# Altium project Aurduino_Nano.PrjPcb
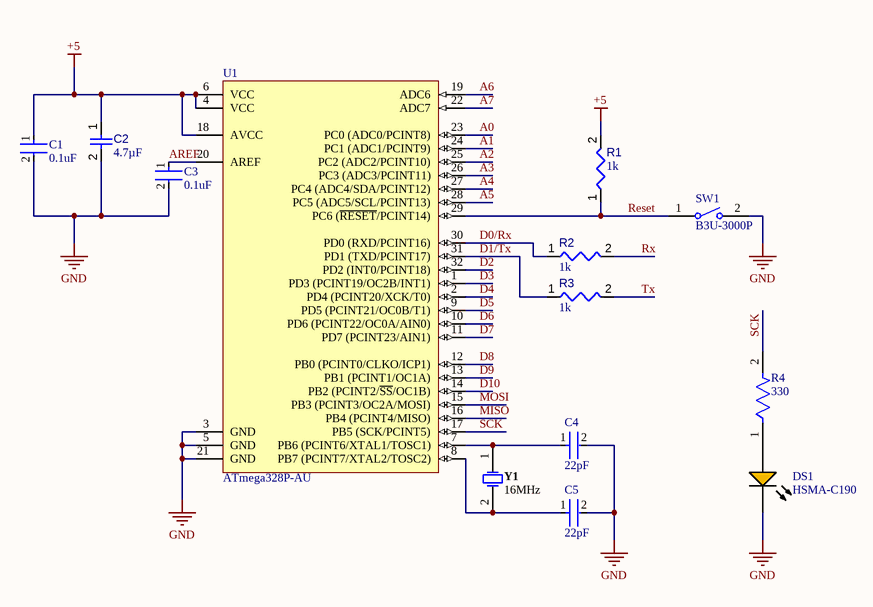
[diagram p0: 1_uC.SchDoc]
3 sheets, 27 parts. Net scope: global (net labels, ports and power ports of the same name join across sheets).
Board file: Aurduino_Nano.PcbDoc
Sheets:
  1_uC.SchDoc
  2_Power_Supply.SchDoc
  3_Connectors.SchDoc

## Sheet 1_uC.SchDoc
size A4; SheetNumber: 1; SheetTotal: 3

### Parts
C1  0.1uF  [FP-C0805C-DN-MFG]
C2  value 4.7µF  [CAPC0805(2012)145_L]  (hidden comment: Capacitor 4.7µF +/-40% 25V 0805)
C3  0.1uF  [FP-C0805C-DN-MFG]
C4  22pF  [FP-C0805C-DN-MFG]
C5  22pF  [FP-C0805C-DN-MFG]
DS1  HSMA-C190  [AVAG-HSMX-C190_V]
R1  value 1k  [RESC0805(2012)_L]  (hidden comment: 1KR5J)
R2  value 1k  [RESC0805(2012)_L]  (hidden comment: 1KR5J)
R3  value 1k  [RESC0805(2012)_L]  (hidden comment: 1KR5J)
R4  330  [FP-CRCW0805-e3-MFG]
SW1  B3U-3000P  [OMRON-B3U-3000P_V]
U1  ATmega328P-AU  [32A_M]
Y1  16MHz  [JPY-X053201602002_V]

### Nets
+5: C1.1 C2.1 R1.2 U1.4(VCC) U1.6(VCC) U1.18(AVCC)
GND: C1.2 C2.2 C3.2 C4.2 C5.2 DS1.2(K) SW1.2 U1.3(GND) U1.5(GND) U1.21(GND)
A0: U1.23(PC0_(ADC0/PCINT8))
A1: U1.24(PC1_(ADC1/PCINT9))
A2: U1.25(PC2_(ADC2/PCINT10))
A3: U1.26(PC3_(ADC3/PCINT11))
A4: U1.27(PC4_(ADC4/SDA/PCINT12))
A5: U1.28(PC5_(ADC5/SCL/PCINT13))
A6: U1.19(ADC6)
A7: U1.22(ADC7)
AREF: C3.1 U1.20(AREF)
D0/Rx: R2.1 U1.30(PD0_(RXD/PCINT16))
D1/Tx: R3.1 U1.31(PD1_(TXD/PCINT17))
D2: U1.32(PD2_(INT0/PCINT18))
D3: U1.1(PD3_(PCINT19/OC2B/INT1))
D4: U1.2(PD4_(PCINT20/XCK/T0))
D5: U1.9(PD5_(PCINT21/OC0B/T1))
D6: U1.10(PD6_(PCINT22/OC0A/AIN0))
D7: U1.11(PD7_(PCINT23/AIN1))
D8: U1.12(PB0_(PCINT0/CLKO/ICP1))
D9: U1.13(PB1_(PCINT1/OC1A))
D10: U1.14(PB2_(PCINT2/~{SS}/OC1B))
MISO: U1.16(PB4_(PCINT4/MISO))
MOSI: U1.15(PB3_(PCINT3/OC2A/MOSI))
Reset: R1.1 SW1.1 U1.29(PC6_(~{RESET}/PCINT14))
Rx: R2.2
SCK: R4.2 U1.17(PB5_(SCK/PCINT5))
Tx: R3.2
NetC4_1: C4.1 U1.7(PB6_(PCINT6/XTAL1/TOSC1)) Y1.1
NetC5_1: C5.1 U1.8(PB7_(PCINT7/XTAL2/TOSC2)) Y1.2
NetDS1_1: DS1.1(A) R4.1

### Library data of the parts
C1 C3 = CMP-03020-002581-2: C0805 0.10 μF X7R 30ppm/°C 20.00% 50 V; Manufacturer Part Number: C0805C104M5RAC; Manufacturer: KEMET; Capacitance: 0.10 μF; Voltage Rating: 50 V; Value: 0.10 μF; Tolerance: 0.2; Material: Ceramic; Category: Cap; Temperature: -55°C to +125°C; Lead Free: Yes; Device Class L3: Ceramic Capacitors; Package: C0805C-DN; Height: 0.88mm; Temperature Range High: +125°C; Device Class L2: Capacitors; Device Class L1: Passive Components; Temperature Coefficient: 30ppm/°C; ComponentLink2Description: Datasheet; RoHS: TRUE; Temperature Range Low: -55°C; ComponentLink2URL: https://content.kemet.com/datasheets/KEM_C1003_C0G_SMD.pdf; Temperature Characteristic: X7R; Mouser Description: Multilayer Ceramic Capacitors MLCC - SMD/SMT 50volts 0.1uF 20% X7R; Octopart: https://octopart.com/c0805c104m5rac-kemet-2226142; Ipc Land Pattern Name: CAPC200125X78; Automotive: No
C2 = CMP-001-00080-4: Chip Capacitor, 4.7µF +/-40%, 25V, 0805, Thickness 1.45 mm; Tolerance: 20%; Voltage Rating: 25V; Min Operating Temperature: -55°C; Max Operating Temperature: 85°C; Pins: 2; Mounting Technology: SMT; Case/Package: 0805
C4 C5 = CMP-03020-014766-1: C0805 22 pF X8R 30ppm/°C 5.00% 50 V; Manufacturer: KEMET; Manufacturer Part Number: C0805C220J5HACTU; Tolerance: 0.05; Voltage Rating: 50 V; Material: Ceramic; Ipc Land Pattern Name: CAPC200125X78; Value: 22 pF; ComponentLink2URL: https://content.kemet.com/datasheets/KEM_C1003_C0G_SMD.pdf; Device Class L1: Passive Components; Package: C0805C-DN; Temperature: -55°C to +125°C; Octopart: https://octopart.com/c0805c220j5hactu-kemet-88697040; Category: Cap; Device Class L3: Ceramic Capacitors; Temperature Range Low: -55°C; ComponentLink2Description: Datasheet; Height: 0.88mm; Device Class L2: Capacitors; Capacitance: 22 pF; Temperature Range High: +125°C; RoHS: TRUE; Automotive: No; Lead Free: Yes; Temperature Coefficient: 30ppm/°C; Temperature Characteristic: X8R
DS1 = CMP-007-00011-2: LED Uni-Color Amber, 60 mW, 20 mA, -40 to 85 degC, 2-Pin SMD, RoHS, Tape and Reel; Manufacturer: Avago; Forward Current: 20mA; Colour: Orange; Luminous Intensity: 90mcd; Lens Style: Diffused; Power: 60mW; Nominal Vf: 1.9V; Viewing Angle: 170degrees; Datasheet Version: Sep-10; Mounting Technology: SM; Case/Package: 0603; RoHS Compliant: True; Pins: 2; Packaging: TapeandReel; Package Reference: HSMX-C190; Manufacturer URL: http://www.avagotech.com/; Package Quantity: 4000; Min Operating Temperature: -40°C; Datasheet URL: http://docs.avagotech.com/docs/AV02-0112EN; Max Operating Temperature: 85°C; Forward Voltage: 1.9V; Package Description: 2-Pin Surface Mount Device, Body 1.6 x 0.8 mm, Height 0.9 mm; Illumination Colour: Orange
R1-R3 = CMP-009-00076-2: 1K 0.125W 5% 0805 (2012 Metric)  SMD; Power: 125mW; Pins: 2; Mounting Technology: SMT; Tolerance: 5%; Case/Package: 0805
R4 = CMP-2001-03823-2: RES Thick Film, 330Ω, 1%, 0.125W, 100ppm/°C, 0805; Voltage Rating (DC): 150V; Resistance: 330R; Max Power Dissipation: 125mW; Mount: Surface Mount; Packaging: Tape and Reel; Min Operating Temperature: -55°C; Military Standard: Not; Case Code (Metric): 2012; Height: 0.02inch; Voltage Rating: 150V; Case/Package: 0805; Max Operating Temperature: 155°C; Width: 0.049inch; Case Code (Imperial): 0805; Termination: SMD/SMT; Lead Free: Lead Free; Contact Plating: Tin; Package Quantity: 10; Composition: Thick Film; Length: 2mm; Features: Automotive AEC-Q200; Depth: 1.25mm; Weight: 0.000194oz; Tolerance: 1%; Power Rating: 125mW; Number of Terminations: 2; Temperature Coefficient: 100ppm/°C
SW1 = CMP-011-00005-2: Tactile Switch, SPST-NO, 0.05 A, 12 V, -25 to 70 degC, 2-Pin SMD, RoHS, Tape and Reel; Manufacturer: Omron Electronic Components; Operating Force: 162gf; Voltage Rating (DC): 12V; Current Rating: 50mA; IP Rating: IP40; Throw Configuration: SPST; Max Contact Resistance: 100mohm; RoHS Compliant: True; Contact Current Rating: 50mA; Manufacturer URL: http://www.omron.com/; Packaging: TapeandReel; Max Voltage Rating (DC): 12V; Contact Material: Silver; Datasheet Version: Jan-15; Package Reference: B3U-3000P; Package Description: 2-Pin Surface Mount Device, Body 4 x 3.2 mm; Min Operating Temperature: -25°C; Package Quantity: 4000; Max Operating Temperature: 70°C; Max Current Rating: 50mA; Voltage Rating: 12V; Case/Package: B3U-3000P; Mounting Technology: SM; Datasheet URL: https://www.omron.com/ecb/products/pdf/en-b3u.pdf
U1 = CMP-0095-00269-2: 8-bit AVR Microcontroller, 32KB Flash, 1KB EEPROM, 2KB SRAM, 32-pin TQFP, Industrial Grade (-40°C to 85°C); PackageDescription: 32-Lead, 7x7x1.0 mm Body, 0.8mm Lead Pitch, Thin Profile Plastic Quad Flat Package (TQFP); DatasheetVersion: revD, May-2011; RevisionNote: DatasheetVersion & PackageVersion updated. URLs added.; ComponentLink1URL: http://www.atmel.com/; ComponentLink2Description: ATmega48A/48PA/88A/88PA/168A/168PA/328/328P Datasheet; Code_JEDEC: MS-026-ABA; ComponentLink1Description: Manufacturer URL; PackageReference: 32A; ComponentLink3Description: ATmega48A/48PA/88A/88PA/168A/168PA/328/328P Summary; ComponentLink2URL: http://www.atmel.com/dyn/resources/prod_documents/doc8271.pdf; PackageVersion: revC, Oct-2010; ComponentLink3URL: http://www.atmel.com/dyn/resources/prod_documents/8271S.pdf
Y1 = CMP-003-00006-2: SMD Crystal, 16 MHz, +/- 20 ppm, 8 pF, -20 to 70 degC, 2-Pin SMD; Manufacturer: Shenzhen Jingpengyuan; Datasheet URL: http://datasheet.octopart.com/X053201602002-Jingpengyuan-datasheet-62330935.pdf; Frequency: 16MHz; RoHS Compliant: Unknown; Case/Package: X053201602002; Manufacturer URL: http://www.chjiahui.com/; Datasheet Version: May-13; Package Reference: X053201602002; Package Description: 2-Pin Surface Mount Device, Body 5 x 3.2 mm; Mounting Technology: SM

## Sheet 2_Power_Supply.SchDoc
size A4; SheetNumber: 2; SheetTotal: 3
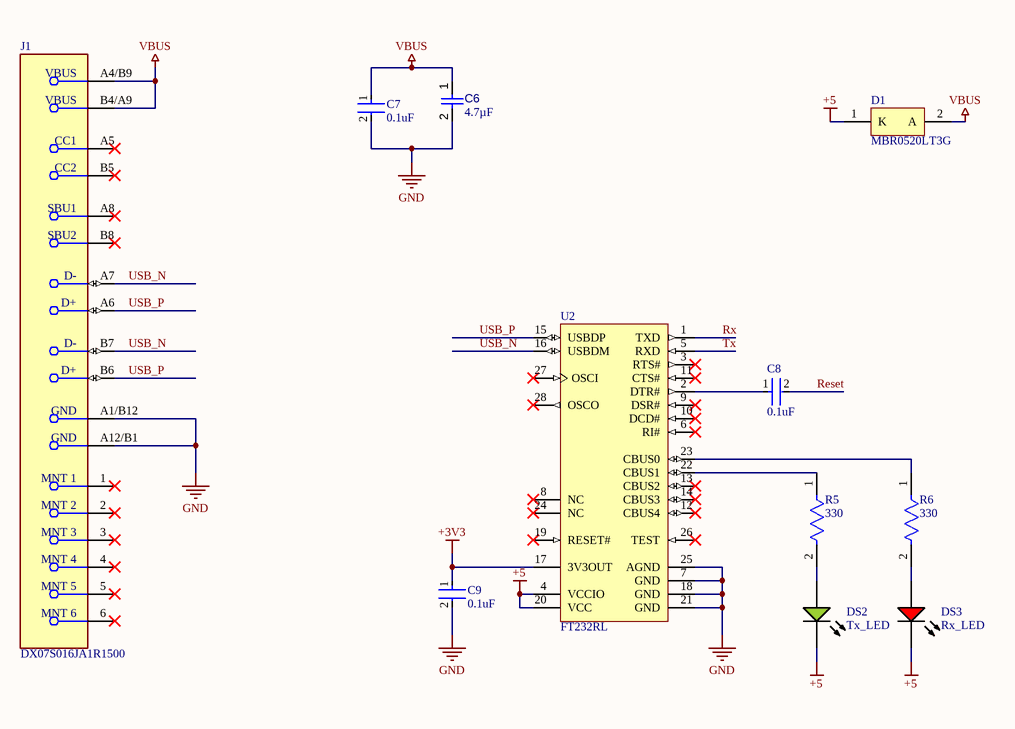
[diagram p1: 2_Power_Supply.SchDoc]

### Parts
C6  value 4.7µF  [CAPC0805(2012)145_L]  (hidden comment: Capacitor 4.7µF +/-40% 25V 0805)
C7  0.1uF  [FP-C0805C-DN-MFG]
C8  0.1uF  [FP-C0805C-DN-MFG]
C9  0.1uF  [FP-C0805C-DN-MFG]
D1  MBR0520LT3G  [ONSC-SOD-123-2-425-04_V]
DS2  Tx_LED  [EVRL-0603-2_V]
DS3  Rx_LED  [EVRL-0603-2_V]
J1  DX07S016JA1R1500  [FP-DX07S016JA1R1500-MFG]
R5  330  [FP-CRCW0805-e3-MFG]
R6  330  [FP-CRCW0805-e3-MFG]
U2  FT232RL  [FTDI-SSOP-28_M]

### Nets
+3V3: C9.1 U2.17(3V3OUT)
+5: D1.1(K) DS2.2(K) DS3.2(K) U2.4(VCCIO) U2.20(VCC)
GND: C6.2 C7.2 C9.2 J1.A1/B12(GND) J1.A12/B1(GND) U2.7(GND) U2.18(GND) U2.21(GND) U2.25(AGND)
VBUS: C6.1 C7.1 D1.2(A) J1.A4/B9(VBUS) J1.B4/A9(VBUS)
Reset: C8.2
Rx: U2.1(TXD)
Tx: U2.5(RXD)
USB_N: J1.A7(D-) J1.B7(D-) U2.16(USBDM)
USB_P: J1.A6(D+) J1.B6(D+) U2.15(USBDP)
NetC8_1: C8.1 U2.2(DTR#)
NetDS2_1: DS2.1(A) R5.2
NetDS3_1: DS3.1(A) R6.2
NetR5_1: R5.1 U2.22(CBUS1)
NetR6_1: R6.1 U2.23(CBUS0)

Not connected (* = marked no-connect by the designer): J1 1(MNT_1)* 2(MNT_2)* 3(MNT_3)* 4(MNT_4)* 5(MNT_5)* 6(MNT_6)* A5(CC1)* A8(SBU1)* B5(CC2)* B8(SBU2)*; U2 3(RTS#)* 6(RI#)* 8(NC)* 9(DSR#)* 10(DCD#)* 11(CTS#)* 12(CBUS4)* 13(CBUS2)* 14(CBUS3)* 19(RESET#)* 24(NC)* 26(TEST)* 27(OSCI)* 28(OSCO)*

### Library data of the parts
C6 = CMP-001-00080-4: as C2 on sheet 1_uC; Voltage Rating: 25V; Min Operating Temperature: -55°C; Max Operating Temperature: 85°C; Pins: 2; Mounting Technology: SMT; Case/Package: 0805
C7-C9 = CMP-03020-002581-2: as C1 on sheet 1_uC; Category: Cap; Temperature: -55°C to +125°C; Lead Free: Yes; Device Class L3: Ceramic Capacitors; Package: C0805C-DN; Height: 0.88mm; Temperature Range High: +125°C; Device Class L2: Capacitors; Device Class L1: Passive Components; Temperature Coefficient: 30ppm/°C; ComponentLink2Description: Datasheet; RoHS: TRUE; Temperature Range Low: -55°C; ComponentLink2URL: https://content.kemet.com/datasheets/KEM_C1003_C0G_SMD.pdf; Temperature Characteristic: X7R; Mouser Description: Multilayer Ceramic Capacitors MLCC - SMD/SMT 50volts 0.1uF 20% X7R; Octopart: https://octopart.com/c0805c104m5rac-kemet-2226142; Ipc Land Pattern Name: CAPC200125X78; Automotive: No
D1 = CMP-1055-00408-1: Schottky Power Rectifier, 2-Pin SOD-123, Pb-Free, Tape and Reel; Manufacturer: On Semiconductor; Configuration: Single; IFSM Max (A): 5.5; PackageReference: SOD-123-2-425-04; ComponentLink3URL: http://www.onsemi.com/pub_link/Collateral/425-04.PDF; Mounting Technology: Surface Mount; PartNumber: MBR0520LT3G; ComponentLink1URL: http://www.onsemi.com/; ComponentLink1Description: Manufacturer URL; Packing: Tape and Reel; PackageDescription: 2-Pin SOD, Body 1.6 x 2.69 mm; ComponentLink2URL: http://www.onsemi.cn/pub_link/Collateral/MBR0520LT1-D.PDF; RoHS: TRUE; ComponentLink3Description: Package Specification; DatasheetVersion: Rev. 6; PackageVersion: Rev. G, 10/2009; ComponentLink2Description: Datasheet
DS2 = CMP-007-00002-2: Chip LED, Yellow-Green, 5 V, 25 mA, -40 to 85 degC, 2-Pin SMD (0603), RoHS, Tape and Reel; Manufacturer: Everlight Electronics; Forward Voltage: 2V; Lens Style: Clear; Viewing Angle: 120degrees; Colour: Green; Mounting Technology: SM; Datasheet Version: Rev. 1, 04/2006; Package Description: 2-Pin Surface Mount Device, Body 1.6 x 0.8 mm; RoHS Compliant: True; Package Reference: 0603; Pins: 2; Manufacturer URL: http://www.everlight.com/; Datasheet URL: https://datasheet.ciiva.com/48679/19-217-g7c-an1p2-3t-48679179.pdf; Case/Package: 0603
DS3 = CMP-007-00004-2: Chip LED, Red, 5 V, 25 mA, -40 to 85 degC, 2-Pin SMD (0603), RoHS, Tape and Reel; Manufacturer: Everlight Electronics; Forward Voltage: 2.2V; Lens Style: Clear; Package Reference: 0603; Datasheet Version: Rev. 1, 01/2005; Mounting Technology: SM; RoHS Compliant: False; Datasheet URL: https://datasheet.ciiva.com/4688/el-19-217-r6c-al1m2vy-3tpdf-187026-4688713.pdf; Case/Package: 0603; Colour: Red; Manufacturer URL: http://www.everlight.com/; Package Description: 2-Pin Surface Mount Device, Body 1.6 x 0.8 mm
J1 = CMP-19038-000003-1: CONN RCP USB2.0 TYP C 24P SMD RA
R5 R6 = CMP-2001-03823-2: as R4 on sheet 1_uC; Mount: Surface Mount; Packaging: Tape and Reel; Min Operating Temperature: -55°C; Military Standard: Not; Case Code (Metric): 2012; Height: 0.02inch; Voltage Rating: 150V; Case/Package: 0805; Max Operating Temperature: 155°C; Width: 0.049inch; Case Code (Imperial): 0805; Termination: SMD/SMT; Lead Free: Lead Free; Contact Plating: Tin; Package Quantity: 10; Composition: Thick Film; Length: 2mm; Features: Automotive AEC-Q200; Depth: 1.25mm; Weight: 0.000194oz; Tolerance: 1%; Power Rating: 125mW; Number of Terminations: 2; Temperature Coefficient: 100ppm/°C
U2 = CMP-2000-05029-1: IC USB FS SERIAL UART 28-SSOP; Manufacturer: FTDI; Receive FIFO: 256B; Number of Channels per Chip: 1; Maximum Data Rate: 3MBd; Transmit FIFO: 128B; Dimensions: 10.2x5.3x1.75mm; Mounting Type: SurfaceMount; Height: 1.75mm; Package Type: SSOP; Datasheet Version: Rev. 1.04, 02/2006; Width: 5.3mm; Manufacturer URL: http://www.ftdichip.com/; Datasheet URL: http://datasheet.octopart.com/FT232RL-FTDI-datasheet-120501.pdf; Maximum Operating Temperature: +85degC; Minimum Operating Temperature: -40degC; Pin Count: 28; Length: 10.2mm

## Sheet 3_Connectors.SchDoc
size A4; SheetNumber: 3; SheetTotal: 3
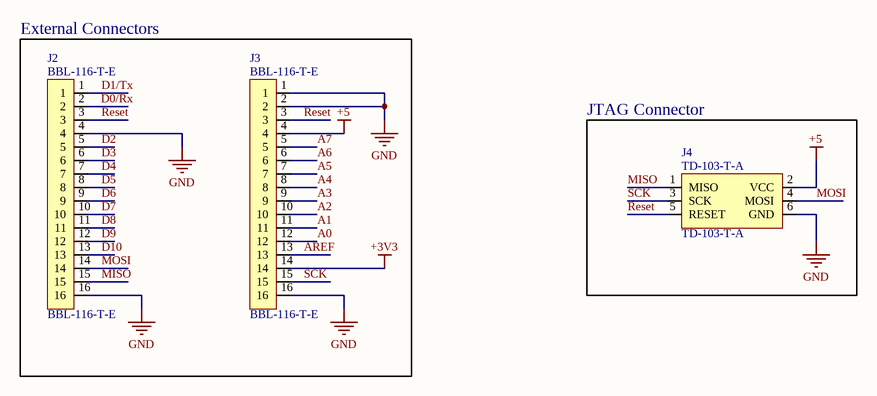
[diagram p2: 3_Connectors.SchDoc]

### Parts
J2  BBL-116-T-E  [BBL-116-T-E]
J3  BBL-116-T-E  [BBL-116-T-E]
J4  TD-103-T-A  [TD-103-T-A]

### Blocks framed on the sheet
External Connectors: J2 J3
JTAG Connector: J4

### Nets
+3V3: J3.14
+5: J3.4 J4.2(VCC)
GND: J2.4 J2.16 J3.1 J3.2 J3.16 J4.6(GND)
A0: J3.12
A1: J3.11
A2: J3.10
A3: J3.9
A4: J3.8
A5: J3.7
A6: J3.6
A7: J3.5
AREF: J3.13
D0/Rx: J2.2
D1/Tx: J2.1
D2: J2.5
D3: J2.6
D4: J2.7
D5: J2.8
D6: J2.9
D7: J2.10
D8: J2.11
D9: J2.12
D10: J2.13
MISO: J2.15 J4.1(MISO)
MOSI: J2.14 J4.4(MOSI)
Reset: J2.3 J3.3 J4.5(RESET)
SCK: J3.15 J4.3(SCK)

### Library data of the parts
J2 J3 = BBL-116-T-E: 16 POS Header, Through Hole
J4 = TD-103-T-A: AVRISP MK2

## Nets that join several sheets
+3V3: 2_Power_Supply (C9.1 U2.17), 3_Connectors (J3.14)
+5: 1_uC (6 pins), 2_Power_Supply (5 pins), 3_Connectors (J3.4 J4.2)
GND: 1_uC (10 pins), 2_Power_Supply (9 pins), 3_Connectors (6 pins)
A0: 1_uC (U1.23), 3_Connectors (J3.12)
A1: 1_uC (U1.24), 3_Connectors (J3.11)
A2: 1_uC (U1.25), 3_Connectors (J3.10)
A3: 1_uC (U1.26), 3_Connectors (J3.9)
A4: 1_uC (U1.27), 3_Connectors (J3.8)
A5: 1_uC (U1.28), 3_Connectors (J3.7)
A6: 1_uC (U1.19), 3_Connectors (J3.6)
A7: 1_uC (U1.22), 3_Connectors (J3.5)
AREF: 1_uC (C3.1 U1.20), 3_Connectors (J3.13)
D0/Rx: 1_uC (R2.1 U1.30), 3_Connectors (J2.2)
D1/Tx: 1_uC (R3.1 U1.31), 3_Connectors (J2.1)
D2: 1_uC (U1.32), 3_Connectors (J2.5)
D3: 1_uC (U1.1), 3_Connectors (J2.6)
D4: 1_uC (U1.2), 3_Connectors (J2.7)
D5: 1_uC (U1.9), 3_Connectors (J2.8)
D6: 1_uC (U1.10), 3_Connectors (J2.9)
D7: 1_uC (U1.11), 3_Connectors (J2.10)
D8: 1_uC (U1.12), 3_Connectors (J2.11)
D9: 1_uC (U1.13), 3_Connectors (J2.12)
D10: 1_uC (U1.14), 3_Connectors (J2.13)
MISO: 1_uC (U1.16), 3_Connectors (J2.15 J4.1)
MOSI: 1_uC (U1.15), 3_Connectors (J2.14 J4.4)
Reset: 1_uC (R1.1 SW1.1 U1.29), 2_Power_Supply (C8.2), 3_Connectors (J2.3 J3.3 J4.5)
Rx: 1_uC (R2.2), 2_Power_Supply (U2.1)
SCK: 1_uC (R4.2 U1.17), 3_Connectors (J3.15 J4.3)
Tx: 1_uC (R3.2), 2_Power_Supply (U2.5)